# EasyEDA schematic 1-Schematic_P0_rpi_nrf24.json
TITLE: P0_rpi_nrf24; REV: 1.0; Date: 2019-06-19; Sheet: 1/1; Drawn By: Francisco Moreno; Company: Universidad de Sevilla
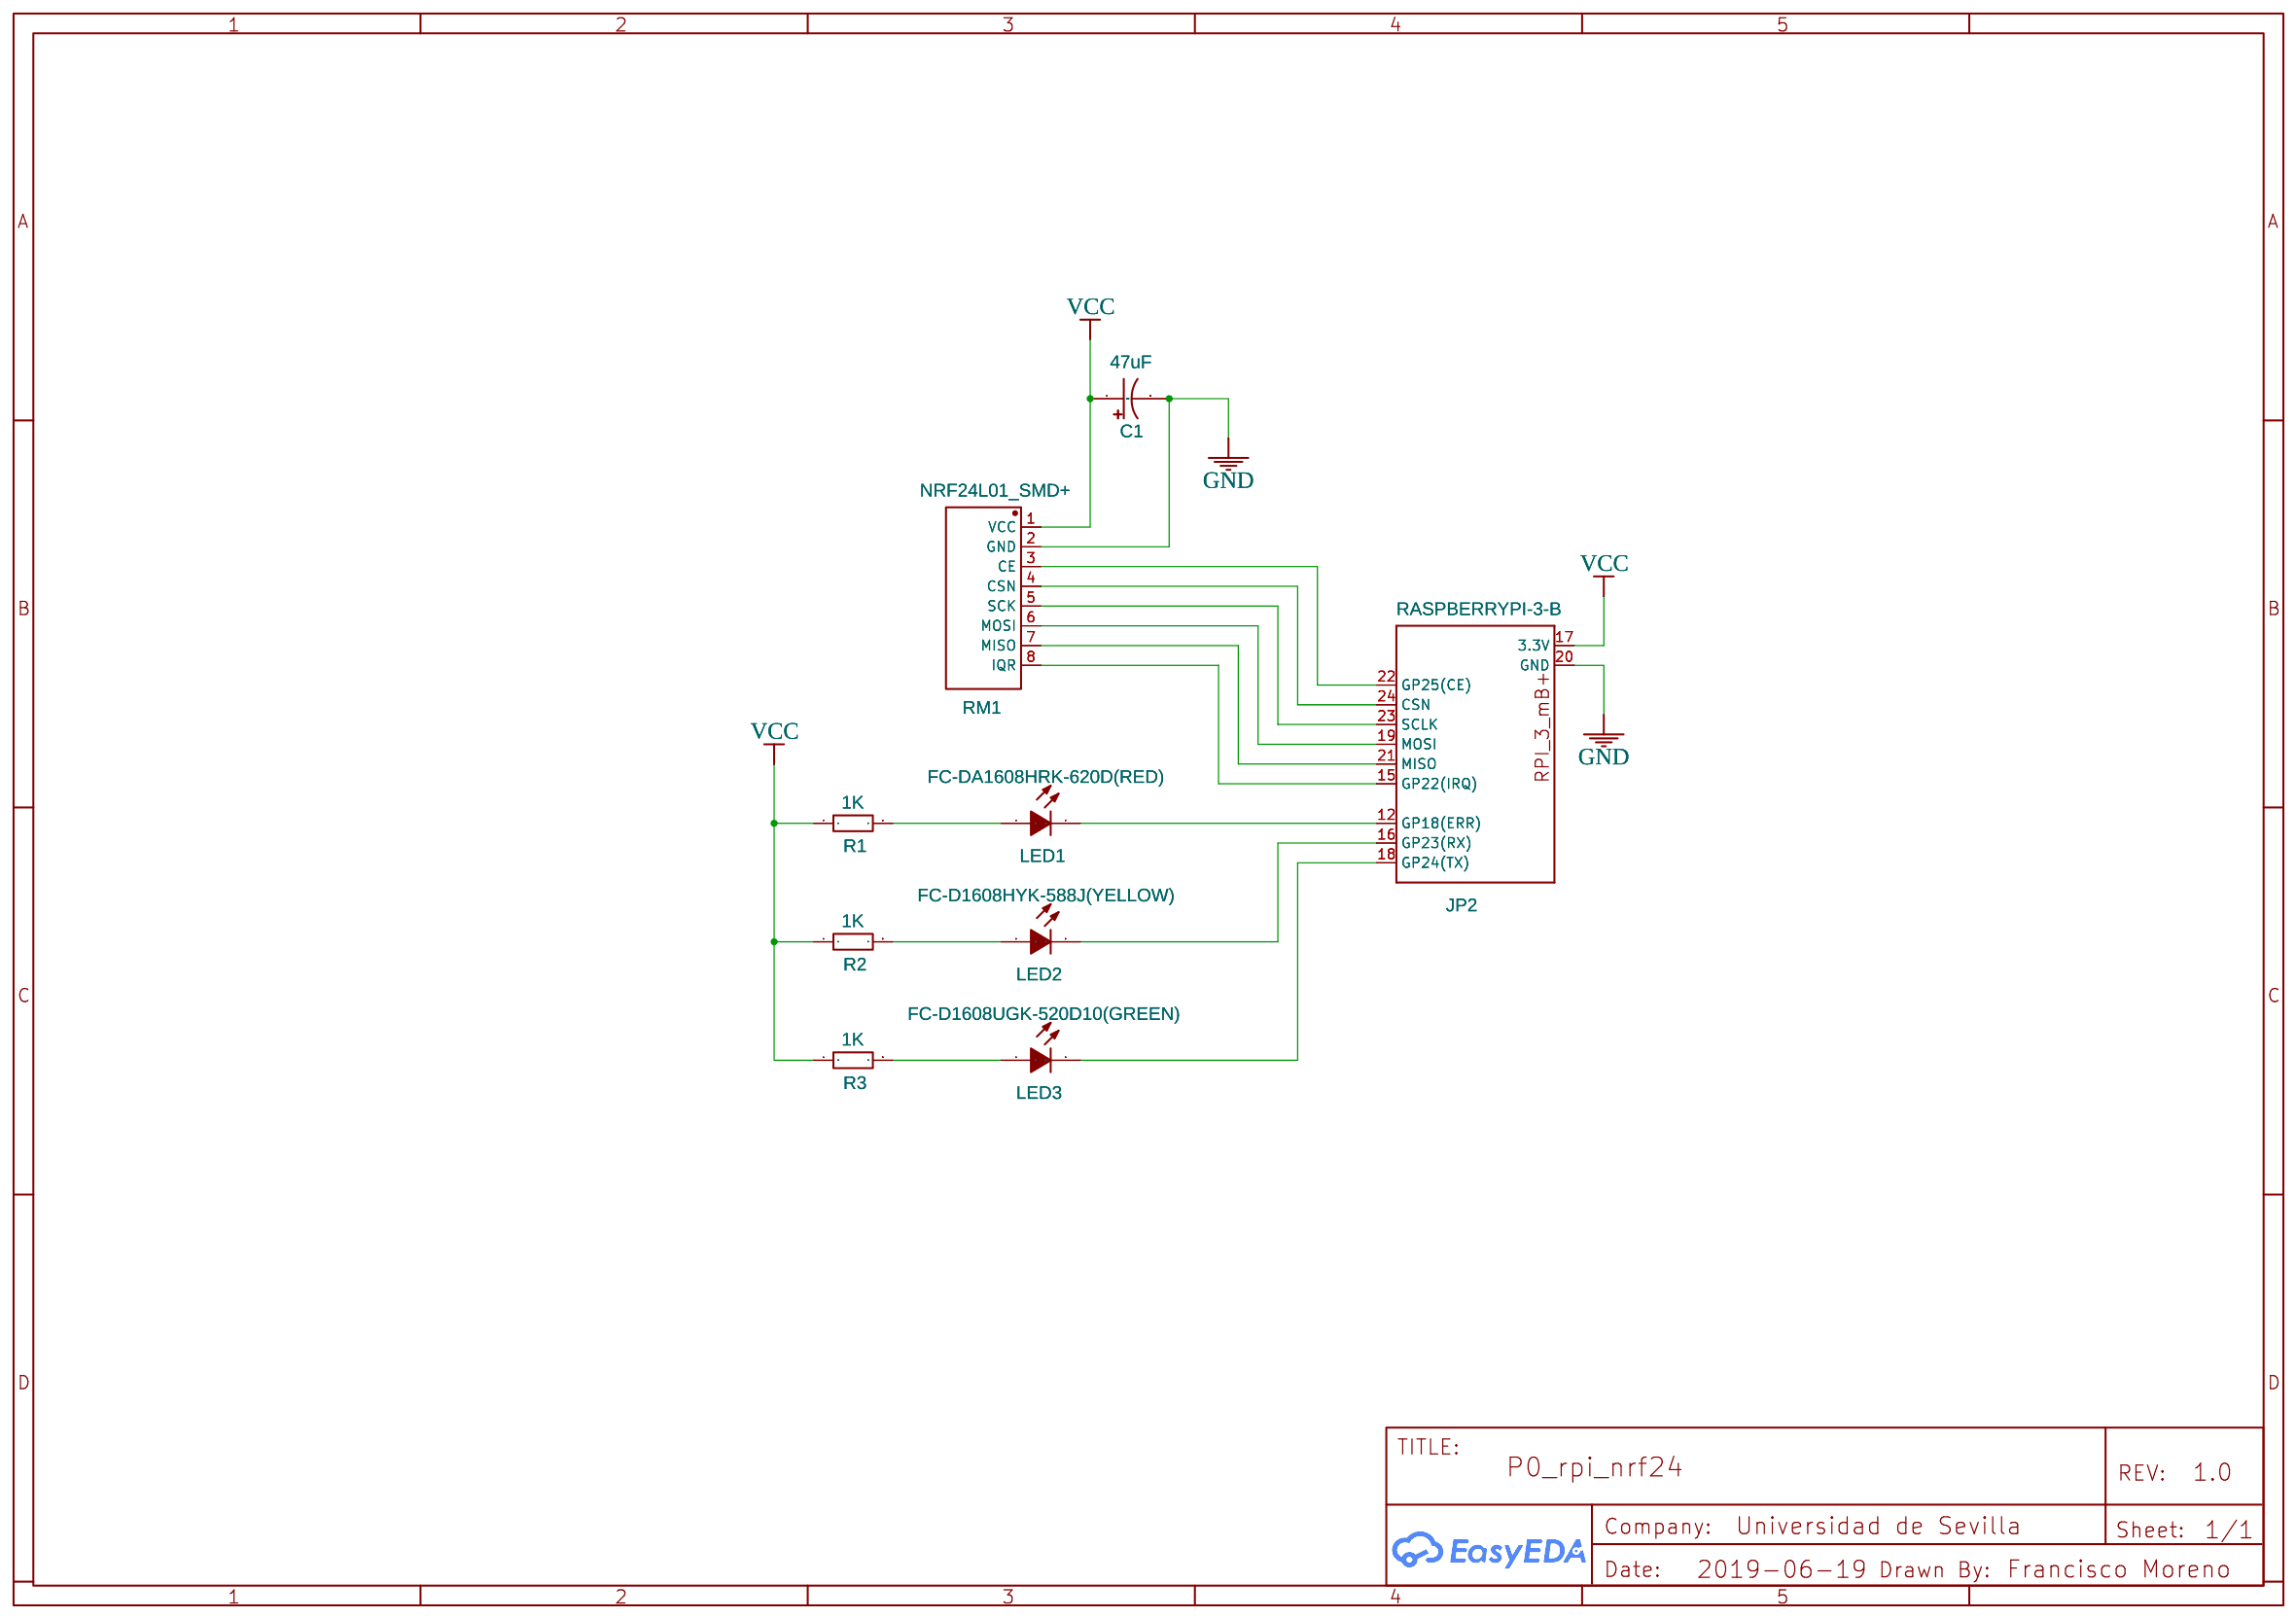
[diagram p0: schematic sheet]

## Parts
C1  47uF  [SMD,6.3X5.4MM]
JP2  RASPBERRYPI-3-B  [2X11-SHROUDED_FOR_RPI_NRF24L01+]
LED1  FC-DA1608HRK-620D(RED)  [LED-0603]
LED2  FC-D1608HYK-588J(YELLOW)  [LED-0603]
LED3  FC-D1608UGK-520D10(GREEN)  [LED-0603]
R1  1K  [1206]
R2  1K  [1206]
R3  1K  [1206]
RM1  NRF24L01_SMD+  [NRF24L01_SMD+]

## Library data of the parts
C1 = RT1V470M0605: Supplier: LCSC; Supplier Part: C267463; Manufacturer: ROQANG; Contributor: LCSC
JP2 = -: Raspberry Pi B+ GPIO Header; Contributor: framortej
LED1 = -: Supplier: LCSC; Manufacturer: NATIONSTAR; Manufacturer Part: FC-DA1608HRK-620D; Supplier Part: C84263
LED2 = -: Supplier: LCSC; Manufacturer: NATIONSTAR; Manufacturer Part: FC-D1608HYK-588J; Supplier Part: C84268; LCSC Assembly: Yes; SMT Type: Extend
LED3 = -: Supplier: LCSC; Manufacturer: NATIONSTAR; Manufacturer Part: FC-D1608UGK-520D10; image: //image.lceda.cn/szlcsc/C84267.jpg; Supplier Part: C84267; LCSC Assembly: Yes; SMT Type: Extend
R1-R3 = 1206W4J0102T5E: Supplier: LCSC; Manufacturer: UniOhm; Supplier Part: C1469
RM1 = -: Supplier: LCSC; Manufacturer Part: ?; Contributor: tiana

## Nets
GND: C1.2 JP2.20(GND) RM1.2(GND)
VCC: C1.1 JP2.17(3.3V) R1.1 R2.1 R3.1 RM1.1(VCC)
Net-(JP2-12): JP2.12(GP18(ERR)) LED1.2(K)
Net-(JP2-15): JP2.15(GP22(IRQ)) RM1.8(IQR)
Net-(JP2-16): JP2.16(GP23(RX)) LED2.2(K)
Net-(JP2-18): JP2.18(GP24(TX)) LED3.2(K)
Net-(JP2-19): JP2.19(MOSI) RM1.6(MOSI)
Net-(JP2-21): JP2.21(MISO) RM1.7(MISO)
Net-(JP2-22): JP2.22(GP25(CE)) RM1.3(CE)
Net-(JP2-23): JP2.23(SCLK) RM1.5(SCK)
Net-(JP2-24): JP2.24(CSN) RM1.4(CSN)
Net-(LED1-1): LED1.1(A) R1.2
Net-(LED2-1): LED2.1(A) R2.2
Net-(LED3-1): LED3.1(A) R3.2
